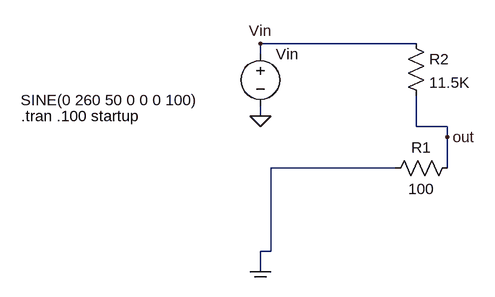
[diagram p0: schematic Test.asc]
Test.asc, the LTspice schematic file:
Version 4
SHEET 1 2524 1536
WIRE 1744 1072 1504 1072
WIRE 1504 1088 1504 1072
WIRE 1504 1184 1504 1168
WIRE 1744 1200 1744 1152
WIRE 1792 1200 1744 1200
WIRE 1792 1216 1792 1200
WIRE 1712 1264 1520 1264
WIRE 1792 1264 1792 1216
WIRE 1520 1392 1520 1264
WIRE 1520 1392 1504 1392
WIRE 1504 1424 1504 1392
FLAG 1504 1184 0
FLAG 1504 1424 COM
FLAG 1792 1216 out
FLAG 1504 1072 Vin
SYMBOL VOLTAGE 1504 1072 R0
WINDOW 3 -369 87 Left 2
WINDOW 123 0 0 Left 0
WINDOW 39 0 0 Left 0
SYMATTR Value SINE(0 260 50 0 0 0 100)
SYMATTR InstName Vin
SYMBOL RES 1808 1248 R90
WINDOW 0 0 56 VBottom 2
WINDOW 3 32 56 VTop 2
WINDOW 38 32 56 VTop 2
WINDOW 39 60 56 VTop 2
WINDOW 40 32 56 VTop 2
WINDOW 123 32 56 VTop 2
SYMATTR InstName R1
SYMATTR Value 100
SYMBOL res 1728 1056 R0
SYMATTR InstName R2
SYMATTR Value 11.5K
SYMATTR SpiceLine tol=1 pwr=0.1
TEXT 1136 1184 Left 2 !.tran .100 startup

The netlist it stands for:
* Test.asc
Vin Vin 0 SINE(0 260 50 0 0 0 100)
R1 out COM 100
R2 Vin out 11.5K tol=1 pwr=0.1
.tran .100 startup
.backanno
.end